# Altium schematic sheet Schematic_Rev1.SchDoc: ESP32-S2 1.54" TFT
size Tabloid; DrawnBy: x; Engineer: x; Address1: Mike Rankin; Address2: 0miker0@gmail.com; Address3: @mikerankin; DocumentNumber: 1; Revision: 1; SheetNumber: 1; SheetTotal: 1; ImagePath: x
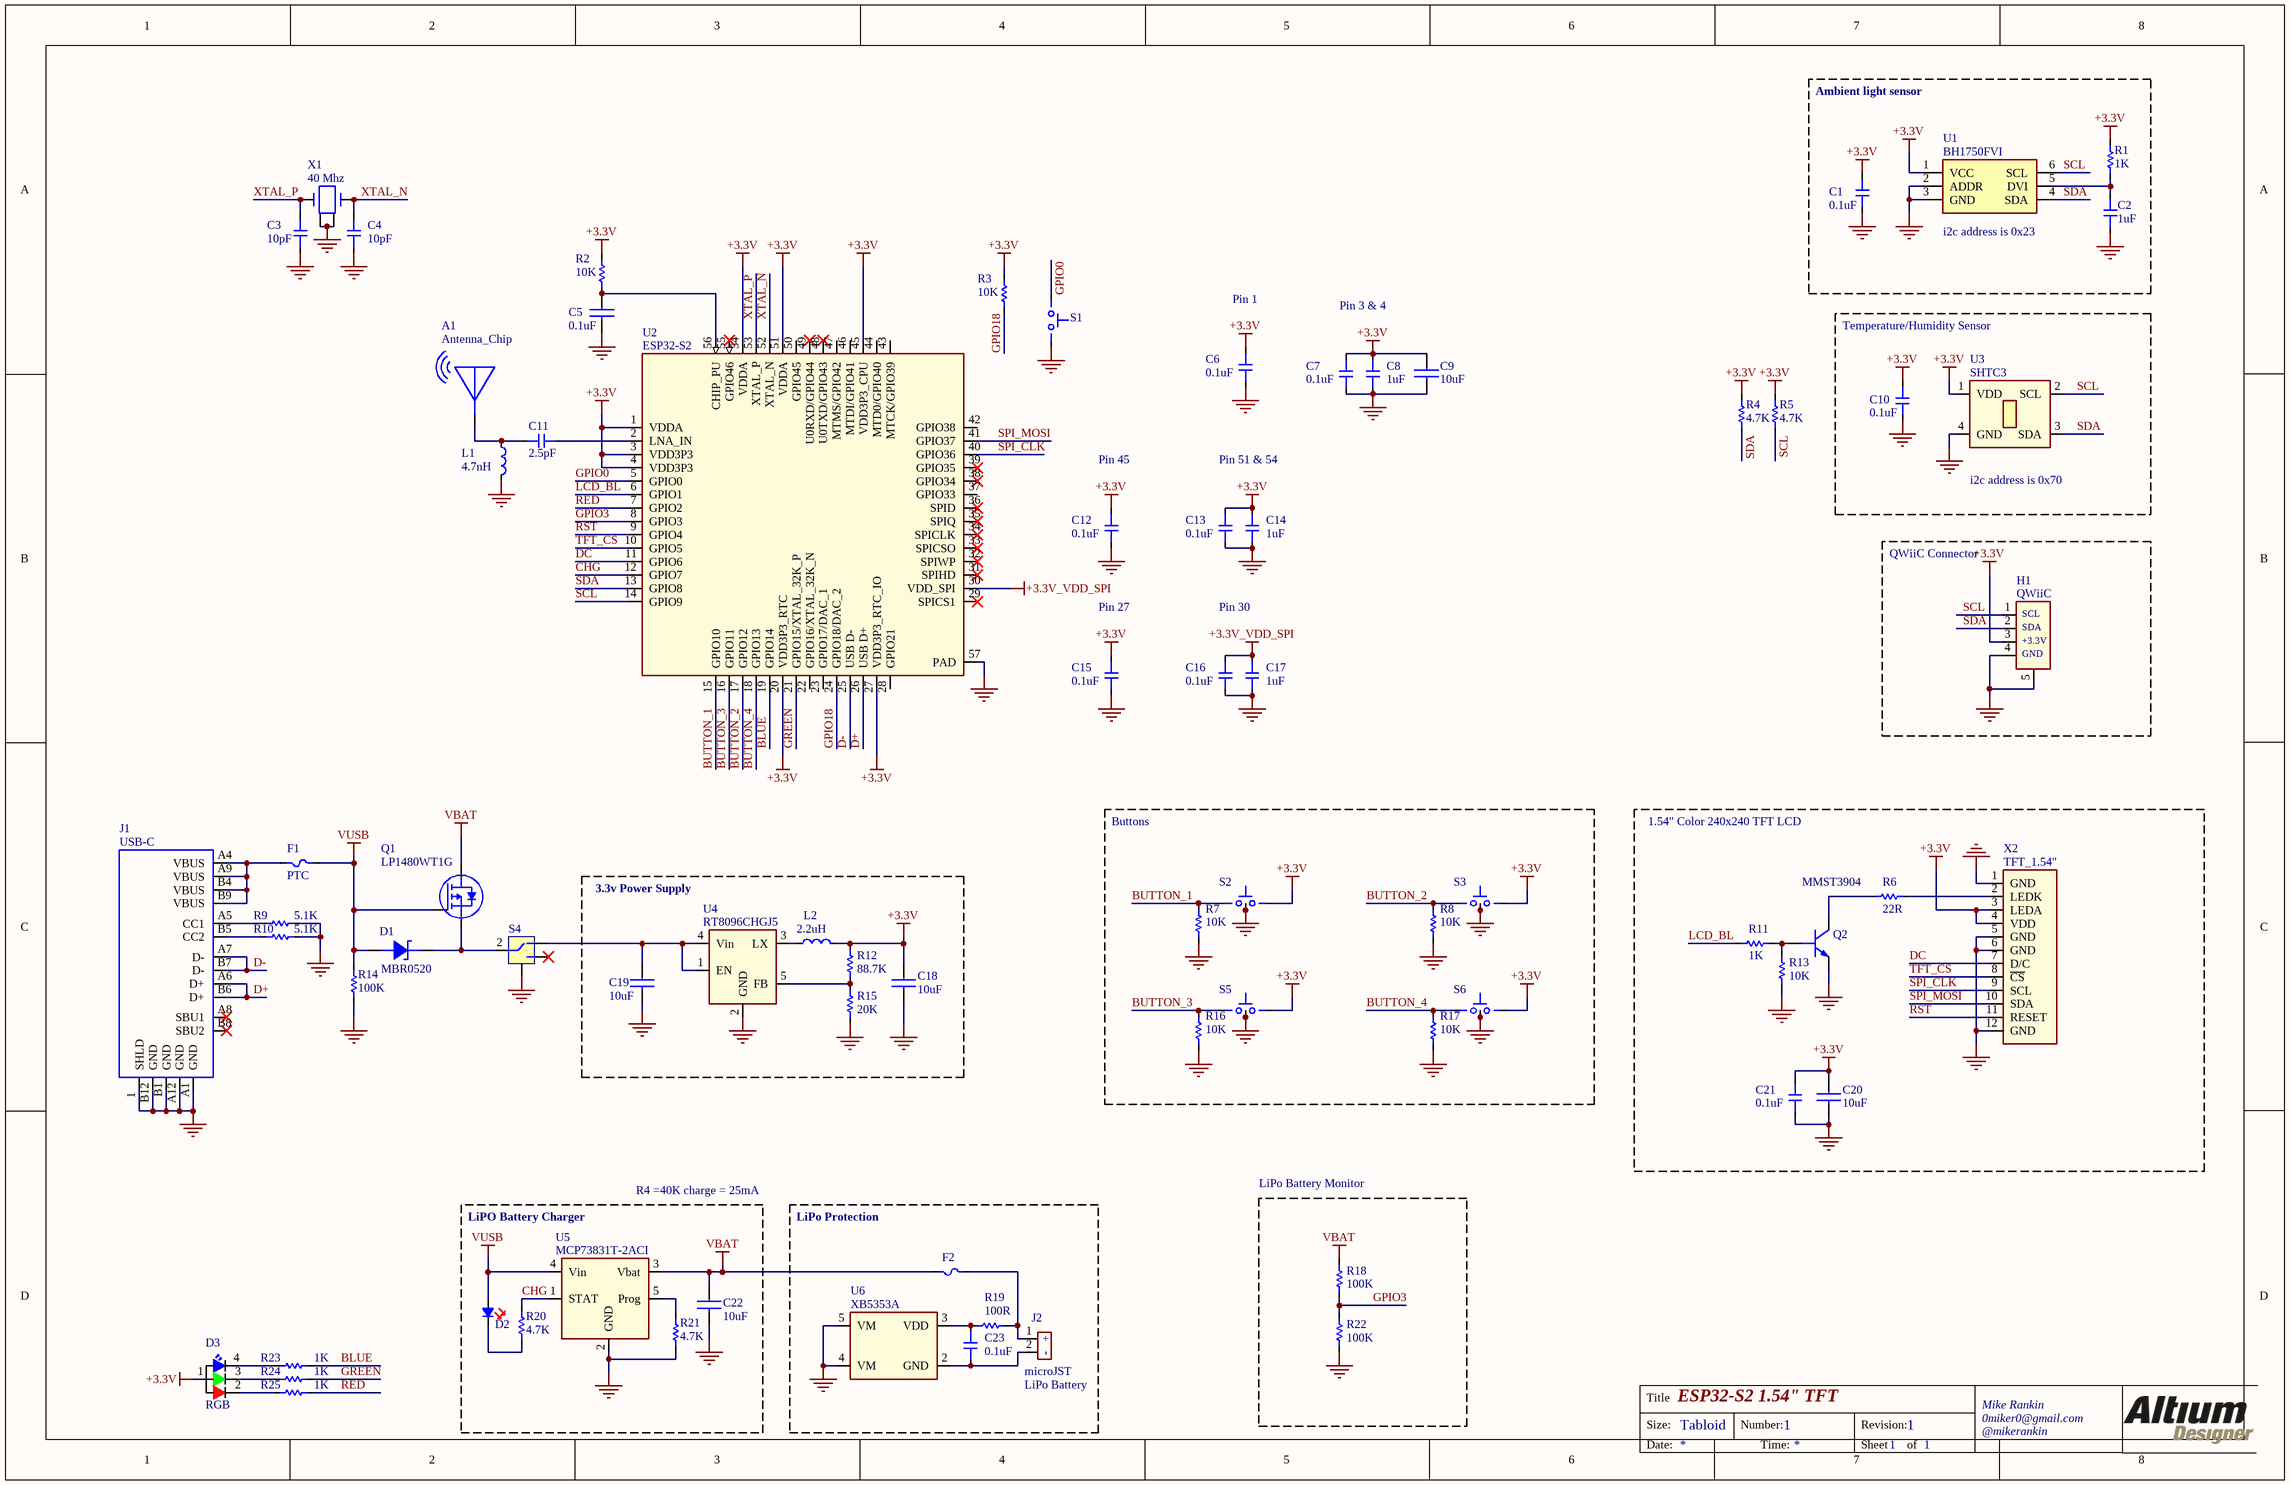
[diagram p0: Schematic_Rev1.SchDoc]

## Parts
A1  Antenna_Chip  [AN9520-245]
C1  0.1uF  [CAPC0603X56N]
C2  1uF  [CAPC1005X56N]
C3  10pF  [CAPC1005X56N]
C4  10pF  [CAPC1005X56N]
C5  0.1uF  [CAPC1005X56N]
C6  0.1uF  [CAPC1005X56N]
C7  0.1uF  [CAPC1005X56N]
C8  1uF  [CAPC1005X56N]
C9  10uF  [CAPC2012X140N]
C10  0.1uF  [CAPC0603X56N]
C11  2.5pF  [CAPC1005X56N]
C12  0.1uF  [CAPC1005X56N]
C13  0.1uF  [CAPC1005X56N]
C14  1uF  [CAPC1005X56N]
C15  0.1uF  [CAPC1005X56N]
C16  0.1uF  [CAPC1005X56N]
C17  1uF  [CAPC1005X56N]
C18  10uF  [CAPC2012X140N]
C19  10uF  [CAPC2012X140N]
C20  10uF  [CAPC2012X140N]
C21  0.1uF  [CAPC1005X56N]
C22  10uF  [CAPC2012X140N]
C23  0.1uF  [CAPC1005X56N]
D1  MBR0520  [SOD123]
D2  Red Led  [LED1005X40N-Red]  (value not drawn)
D3  RGB  [FC-B1010RGBT-HG]
F1  TLC-PSMD050  [PTC2012X70L]  (value not drawn)
F2  TLC-PSMD050  [PTC2012X70L]  (value not drawn)
H1  QWiiC  [SM04B-SRSS-TB]
J1  USB-C  [TYPE-C-31-M-12]
J2  CON2  [JST_Micro_2PIN]  (value not drawn)  (no BOM)
L1  4.7nH  [INDC1005X40L]
L2  2.2uH  [IND_2mmx2mm]
Q1  LP1480WT1G  [SC-70]
Q2  MMST3904  [SC-70]
R1  1K  [RESC1005X40L (0402 FOOTPRINT)]
R2  10K  [RESC1005X40L (0402 FOOTPRINT)]
R3  10K  [RESC1005X40L (0402 FOOTPRINT)]
R4  4.7K  [RESC1005X40L (0402 FOOTPRINT)]
R5  4.7K  [RESC1005X40L (0402 FOOTPRINT)]
R6  22R  [RESC1005X40L (0402 FOOTPRINT)]
R7  10K  [RESC1005X40L (0402 FOOTPRINT)]
R8  10K  [RESC1005X40L (0402 FOOTPRINT)]
R9  5.1K  [RESC1005X40L (0402 FOOTPRINT)]
R10  5.1K  [RESC1005X40L (0402 FOOTPRINT)]
R11  1K  [RESC1005X40L (0402 FOOTPRINT)]
R12  88.7K  [RESC1005X40L (0402 FOOTPRINT)]
R13  10K  [RESC1005X40L (0402 FOOTPRINT)]
R14  100K  [RESC1005X40L (0402 FOOTPRINT)]
R15  20K  [RESC1005X40L (0402 FOOTPRINT)]
R16  10K  [RESC1005X40L (0402 FOOTPRINT)]
R17  10K  [RESC1005X40L (0402 FOOTPRINT)]
R18  100K  [RESC1005X40L (0402 FOOTPRINT)]
R19  100R  [RESC1005X40L (0402 FOOTPRINT)]
R20  4.7K  [RESC1005X40L (0402 FOOTPRINT)]
R21  4.7K  [RESC1005X40L (0402 FOOTPRINT)]
R22  100K  [RESC1005X40L (0402 FOOTPRINT)]
R23  1K  [RESC1005X40L (0402 FOOTPRINT)]
R24  1K  [RESC1005X40L (0402 FOOTPRINT)]
R25  1K  [RESC1005X40L (0402 FOOTPRINT)]
S1  (no value)  [TS-1088R-02526]
S2  Push  [122514]  (value not drawn)
S3  Push  [122514]  (value not drawn)
S4  SWITCH SLIDE  [K3-1296S-E1]  (value not drawn)
S5  Push  [122514]  (value not drawn)
S6  Push  [122514]  (value not drawn)
U1  BH1750FVI  [WSOF-6]
U2  ESP32-S2  [QFN56_0.4mm pitch]
U3  SHTC3  [DFN-4 (2.0mm X 2.0mm)]
U4  RT8096CHGJ5  [SOT95P280X144-5N]
U5  value MCP73831T-2ACI  [SOT95P280X144-5N]  (hidden comment: MCP73831T-2ACI/OT)
U6  XB5353A  [SOT95P280X144-5N]
X1  40 Mhz  [OSC20X16]
X2  TFT_1.54"  [TFT_GLASS 1.54 INCH]

## Blocks framed on the sheet
QWiiC Connector: H1
Buttons: R7 R8 R16 R17 S2 S3 S5 S6
1.54" Color 240x240 TFT LCD: C20 C21 Q2 R6 R11 R13 X2
3.3v Power Supply: C18 C19 L2 R12 R15 U4
LiPo Battery Monitor: R18 R22

## Nets
+3.3V: C1.1 C6.1 C7.1 C8.1 C9.1 C10.1 C12.1 C13.1 C14.1 C15.1 C18.1 C20.1 C21.1 D3.1 H1.3 L2.2 R1.1 R2.1 R3.1 R4.2 R5.2 R12.2 S2.2(B) S3.2(B) S5.2(B) S6.2(B) U1.1(VCC) U2.1(VDDA) U2.3(VDD3P3) U2.4(VDD3P3) U2.20(VDD3P3_RTC) U2.27(VDD3P3_RTC_IO) U2.45(VDD3P3_CPU) U2.51(VDDA) U2.54(VDDA) U3.1(VDD) X2.3(LEDA) X2.4(VDD)
+3.3V_VDD_SPI: C16.1 C17.1 U2.30(VDD_SPI)
GND: C1.2 C2.2 C3.2 C4.2 C5.2 C6.2 C7.2 C8.2 C9.2 C10.2 C12.2 C13.2 C14.2 C15.2 C16.2 C17.2 C18.2 C19.2 C20.2 C21.2 C22.2 H1.4 H1.5 J1.1(SHLD) J1.A1(GND) J1.A12(GND) J1.B1(GND) J1.B12(GND) L1.2 Q2.2(E) R7.2 R8.2 R9.1 R10.1 R13.2 R14.2 R15.1 R16.2 R17.2 R21.2 R22.2 S1.2(B) S2.3 S2.4 S3.3 S3.4 S4.4 S5.3 S5.4 S6.3 S6.4 U1.2(ADDR) U1.3(GND) U2.57(PAD) U3.4(GND) U4.2(GND) U5.2(GND) U6.4(VM) U6.5(VM) X1.2 X1.4 X2.1(GND) X2.5(GND) X2.6(GND) X2.12(GND)
VBAT: C22.1 F2.2 Q1.3(D) R18.1 U5.3(Vbat)
VUSB: D1.2(Annode) D2.2 F1.1 Q1.1(G) R14.1 U5.4(Vin)
BLUE: R23.2 U2.19(GPIO14)
BUTTON_1: R7.1 S2.1(A) U2.15(GPIO10)
BUTTON_2: R8.1 S3.1(A) U2.17(GPIO12)
BUTTON_3: R16.1 S5.1(A) U2.16(GPIO11)
BUTTON_4: R17.1 S6.1(A) U2.18(GPIO13)
CHG: R20.1 U2.12(GPIO7) U5.1(STAT)
D+: J1.A6(D+) J1.B6(D+) U2.26(USB_D+)
D-: J1.A7(D-) J1.B7(D-) U2.25(USB_D-)
DC: U2.11(GPIO6) X2.7(D/C)
GPIO0: S1.1(A) U2.5(GPIO0)
GPIO3: R18.2 R22.1 U2.8(GPIO3)
GPIO18: R3.2 U2.24(GPIO18/DAC_2)
GREEN: R24.2 U2.21(GPIO15/XTAL_32K_P)
LCD_BL: R11.1 U2.6(GPIO1)
RED: R25.2 U2.7(GPIO2)
RST: U2.9(GPIO4) X2.11(RESET)
SCL: H1.1 R5.1 U1.6(SCL) U2.14(GPIO9) U3.2(SCL)
SDA: H1.2 R4.1 U1.4(SDA) U2.13(GPIO8) U3.3(SDA)
SPI_CLK: U2.40(GPIO36) X2.9(SCL)
SPI_MOSI: U2.41(GPIO37) X2.10(SDA)
TFT_CS: U2.10(GPIO5) X2.8(~{CS})
XTAL_N: C4.1 U2.52(XTAL_N) X1.3
XTAL_P: C3.1 U2.53(XTAL_P) X1.1
NetA1_1: A1.1 C11.1 L1.1
NetC2_1: C2.1 R1.2 U1.5(DVI)
NetC5_1: C5.1 R2.2 U2.56(CHIP_PU)
NetC11_2: C11.2 U2.2(LNA_IN)
NetC19_1: C19.1 S4.1 U4.1(EN) U4.4(Vin)
NetC23_1: C23.1 R19.2 U6.3(VDD)
NetC23_2: C23.2 J2.2 U6.2(GND)
NetD1_1: D1.1(Cathode) Q1.2(S) S4.2
NetD2_1: D2.1 R20.2
NetD3_2: D3.2 R25.1
NetD3_3: D3.3 R24.1
NetD3_4: D3.4 R23.1
NetF1_2: F1.2 J1.A4(VBUS) J1.A9(VBUS) J1.B4(VBUS) J1.B9(VBUS)
NetF2_1: F2.1 J2.1 R19.1
NetJ1_A5: J1.A5(CC1) R9.2
NetJ1_B5: J1.B5(CC2) R10.2
NetL2_1: L2.1 U4.3(LX)
NetQ2_1: Q2.1(B) R11.2 R13.1
NetQ2_3: Q2.3(C) R6.2
NetR6_1: R6.1 X2.2(LEDK)
NetR12_1: R12.1 R15.2 U4.5(FB)
NetR21_1: R21.1 U5.5(Prog)

Not connected (* = marked no-connect by the designer): J1 A8(SBU1)* B8(SBU2)*; S4 3*; U2 22(GPIO16/XTAL_32K_N) 23(GPIO17/DAC_1) 28(GPIO21) 29(SPICS1)* 31(SPIHD)* 32(SPIWP)* 33(SPICSO)* 34(SPICLK)* 35(SPIQ)* 36(SPID)* 37(GPIO33) 38(GPIO34)* 39(GPIO35)* 42(GPIO38) 43(MTCK/GPIO39) 44(MTD0/GPIO40) 46(MTDI/GPIO41) 47(MTMS/GPIO42) 48(U0TXD/GPIO43)* 49(U0RXD/GPIO44)* 50(GPIO45) 55(GPIO46)*

## Notes on the sheet
- Ambient light sensor
- (near C6) Pin 1
- (near U1) i2c address is 0x23
- Pin 3 & 4
- Temperature/Humidity Sensor
- (near C12) Pin 45
- Pin 51 & 54
- (near U3) i2c address is 0x70
- Pin 27
- Pin 30
- (near F1) PTC
- (near U5) LiPO Battery Charger
- R4 =40K charge = 25mA
- LiPo Protection
- (near J2) microJST
- (near J2) LiPo Battery
- Title
- Size:
- Tabloid
- Number:
- Revision:
- Date:
- Time:
- Sheet
- of
- (in symbol JST_Micro_CONN_2PIN) +; -
- (in symbol SM04B-SRSS-TB) SCL; SDA; +3.3V; GND

## Library data of the parts
A1 = Antenna_Chip: Antenna Chip 2.4Gig; Manufacturer: Rainsun; Value: Chip Antenna; Vendor: LCSC; LCSC_Part_Number: C99665; Man_Part_Number: AN9520-245
C1 C10 = CAP_0201: CAP 0.1uF 0201; PartFootprint: 0402; Vendor: LCSC; Value: 0.1uF
C2 C8 C14 = CAP_0402: CAP 1uF 0402; Part_Footprint: 0402; Vendor: LCSC; Value: 1uF
C3 C4 = CAP_0402: CAP 10pF 0402; Part_Footprint: 0402; Vendor: LCSC; Value: 10pF
C5 = CAP_0402: CAP 0.1uF 0402; Manufacturer: CCTC; Man_Part_Number: TCC0402X5R104M160AT; Vendor: LCSC; LCSC_Part_Number: C344190; Value: 0.1uF
C6 C7 C12 C13 C15-C17 C21 C23 = CAP_0402: CAP 0.1uF 0402; Part_Footprint: 0402; Vendor: LCSC
  C6 C7 C12 C13 C15 C16 C21 C23: Value: 0.1uF
  C17: Value: 1uF
C9 C18 C19 = CAP_0805: CAP 10uF 0805; Value: 10uF
C11 = CAP_0402: CAP 2.5pF 0402; Part_Footprint: 0402; Vendor: LCSC; Value: 2.5pF
C20 = CAP_0805: CAP 10uF 0805; Manufacturer: Samsung; Man_Part_Number: CL21A106KOQNNNG; Vendor: LCSC; LCSC_Part_Number: C307520; Value: 10uF
C22 = CAP_0805: CAP 10uF 0805; PartNumber: C307520; Manufacturer: Samsung; Vendor: LCSC; Value: 10uF
D1 = MBR0520-TP: DIODE SCHOTTKY 20V 500MA SOD123; Manufacturer: CJ; Vendor: LCSC; LCSC_Part_Number: C475717; Value: MBR0520; Man_Part_Number: MBR0520
D2 = LED_0402_SMALL_Red: LED Red 0402; Part_Number: C364556; Manufacturer: Lite-On; Part_Footprint: 0402; Vendor: LCSC; Value: Red Led
D3 = FC-B1010RGBT-HG: LED,RGB LED,SMD,RoHS; Manufacturer: Foshan; Vendor: LCSC; Value: RGB Led; LCSC_Part_Number: C158099; Man_Part_Number: FC-B1010RGBT-HG
F1 F2 = PTC_FUSE: PTC FUSE 500mA hold, 1A trip 0805 SMD; Manufacturer: TLC; Vendor: LCSC; LCSC_Part_Number: C261942; Value: TLC-PSMD050; Man_Part_Number: TLC-PSMD050
H1 = SM04B-SRSS-TB: CONN HEADER 4POS .100 R/A QWIIC; Manufacturer: JST; PartNumber: SM04B-SRSS-TB(LF)(SN); Vendor: LCSC; Value: QWiiC; Man_Part_Number: SM04B-SRSS-TB(LF)(SN); LCSC_Part_Number: C160404
J1 = USB-C: CONN RECPT USB-C; Manufacturer: KHE; Part_Number: C165948; Part_Footprint: SMT; Vendor: LCSC; Value: USB-C
J2 = JST_Micro_CONN_2PIN: JST MIcro CONN 2POS
L1 = Inductor: Inductor 4.7nH 0402; Value: 4.7nH; Part_Footprint: *
L2 = Inductor
Q1 = LP1480WT1G: MOSFET P-CH 20V 1.4A SC-70; Manufacturer: LRC; Vendor: LCSC; Value: P-CH Mosfet; Part_Footprint: SC-70; LCSC_Part_Number: C172434; Man_Part_Number: LP1480WT1G
Q2 = MMST3904: TRANSISTOR NPN GP 40V SC-70; Manufacturer: Changjiang; Vendor: LCSC; LCSC_Part_Number: C54879; Part_Footprint: SC-70; Value: MMST3904; Man_Part_Number: MMST3904
R1 = RES_0402: RES 1K 0402; Part_Footprint: 0402; Vendor: LCSC; Value: 1K
R2 R3 R13 = RES_0402: RES 10K 0402; Manufacturer: Guangdong; Man_Part_Number: RC-02W1002FT; Vendor: LCSC; LCSC_Part_Number: C258091; Value: 10K
R4 R5 = RES_0402: RES 4.7K 0402; Manufacturer: Uni-Royal; Man_Part_Number: 0402WGF4701TCE; Vendor: LCSC; LCSC_Part_Number: C25900; Value: 4.7K
R6 = RES_0402: RES 22R 0402; Manufacturer: Uniroyal; Man_Part_Number: 0402WGF220JTCE; Vendor: LCSC; LCSC_Part_Number: C25092; Value: 22R
R7 R8 R16 R17 = RES_0402: RES 10K 0402; Manufacturer: Guangdong; Part_Footprint: 0402; Man_Part_Number: RC-02W1002FT; Vendor: LCSC; LCSC_Part_Number: C258091; Value: 10K
R9 R10 = RES_0402: RES 5.1K 0402; Part_Footprint: 0402; Vendor: LCSC; Value: 5.1K
R11 R23-R25 = RES_0402: RES 1K 0402; Manufacturer: Yageo; Man_Part_Number: RC0402FR-071KL; Vendor: LCSC; LCSC_Part_Number: C106235; Value: 1K
R12 = RES_0402: RES 88.7K 0402; Value: 88.7K
R14 = RES_0402: RES 100K 0402; Part_Footprint: 0402; Vendor: LCSC; Value: 100K
R15 = RES_0402: RES 20K 0402; Value: 20K
R18 R22 = RES_0603: RES 100K 0402; Manufacturer: Uniroyal Elec; Man_Part_Number: 0402WGF1003TCE; Vendor: LCSC; LCSC_Part_Number: C25741; Value: 100K
R19 = RES_0402: RES 100R 0402; Part_Footprint: 0402; Vendor: LCSC; Value: 100R
R20 R21 = RES_0402: RES 4.7K 0402; Part_Footprint: 0402; Vendor: LCSC; Value: 4.7K
S1 = TS-1088R-02526: Tactile Micro Switch; Part_Number: C455281; Manufacturer: XUNPU; Part_Footprint: SMD; Vendor: LCSC
S2 S3 S5 S6 = Side Actuated Button R/A: Manufacturer: HYP; Man_Part_Number: 1TS002G-2300-3500-CT; Vendor: LCSC; LCSC_Part_Number: C319377; Value: Button R/A
S4 = K3-1296S-E1: SWITCH SLIDE SMD; Manufacturer: Korean Hroparts Elec; Vendor: LCSC; LCSC_Part_Number: C128955; Value: SWITCH SLIDE; Man_Part_Number: K3-1296S-E1
U1 = BH1750FVI: Optical Sensor Ambient I2C 6-SMD; Manufacturer: Rohm; Part_Footprint: 6WSOF; Part_Number: C78960; Vendor: LCSC; Value: BH1750FVI
U2 = ESP32-S2: WIFI/Bluetooth, QFN-56 7x7; Manufacturer: Espressif; Part_Number: C529594; Part_Footprint: QFN56; Vendor: LCSC; Value: ESP32-S2
U3 = SHTC3: Humidity/Temperature Sensor; Manufacturer: Sensirion; Vendor: LCSC; Value: Temp/Humid; Part_Number: SHTC3
U4 = RT8096CHGJ5: IC DC SWITCHING REG 1A SOT23-5; Manufacturer: Richtek; Vendor: LCSC; PartNumber: RT8096CHGJ5
U5 = MCP73831T-2ACI/OT: Charger IC Lithium-Ion/Polymer SOT23-5; Manufacturer: Microchip; Part_Footprint: SOT-23-5L; Vendor: LCSC; Man_Part_Number: MCP73831T-2ACI/OT; LCSC_Part_Number: C424093
U6 = XB5353A: IC Battery Protection; Manufacturer: XySemi; Part_Footprint: SOT23-5; Vendor: LCSC; LCSC_Part_Number: C80628; Man_Part_Number: XB5353A; Value: XB5353A
X1 = 40Mhz: CRYSTAL 40MHZ 10PF SMD; Part_Number: ECS-400-10-37B2-CKM; Manufacturer: ECS; Vendor: Digi-Key; Value: 40 Mhz
X2 = TFT_GLASS 1.54 INCH COLOR: 1.54 INCH TFT GLASS COLOR; Man_Part_Number: ER-TFT1.54-1; Manufacturer: BuyDisplay; Vendor: BuyDisplay; Value: TFT_1.54"